# Altium schematic sheet I2cLevelShifter.SchDoc
size A; DocumentNumber: D_21; SheetNumber: 21; SheetTotal: 21
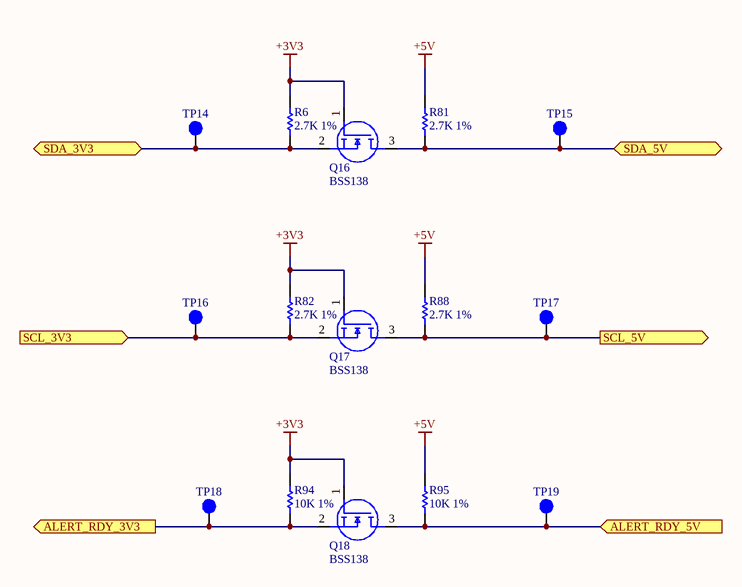
[diagram p0: I2cLevelShifter.SchDoc]

## Parts
Q16  BSS138  [SOT-23-3]
Q17  BSS138  [SOT-23-3]
Q18  BSS138  [SOT-23-3]
R6  2.7K 1%  [R0805]
R81  2.7K 1%  [R0805]
R82  2.7K 1%  [R0805]
R88  2.7K 1%  [R0805]
R94  10K 1%  [R0805]
R95  10K 1%  [R0805]
TP14  T  [TESTPOINTSMD_1x1MM]  (value not drawn)  (no BOM)
TP15  T  [TESTPOINTSMD_1x1MM]  (value not drawn)  (no BOM)
TP16  T  [TESTPOINTSMD_1x1MM]  (value not drawn)  (no BOM)
TP17  T  [TESTPOINTSMD_1x1MM]  (value not drawn)  (no BOM)
TP18  T  [TESTPOINTSMD_1x1MM]  (value not drawn)  (no BOM)
TP19  T  [TESTPOINTSMD_1x1MM]  (value not drawn)  (no BOM)

## Ports
ALERT_RDY_3V3 (out), ALERT_RDY_5V (in), SCL_3V3 (in), SCL_5V (out), SDA_3V3 (bidir), SDA_5V (bidir)

## Nets
+3V3: Q16.1(G) Q17.1(G) Q18.1(G) R6.2 R82.2 R94.2
+5V: R81.2 R88.2 R95.2
ALERT_RDY_3V3: Q18.2(S) R94.1 TP18.1 ; port ALERT_RDY_3V3
ALERT_RDY_5V: Q18.3(D) R95.1 TP19.1 ; port ALERT_RDY_5V
SCL_3V3: Q17.2(S) R82.1 TP16.1 ; port SCL_3V3
SCL_5V: Q17.3(D) R88.1 TP17.1 ; port SCL_5V
SDA_3V3: Q16.2(S) R6.1 TP14.1 ; port SDA_3V3
SDA_5V: Q16.3(D) R81.1 TP15.1 ; port SDA_5V

## Library data of the parts
Q16-Q18 = BSS138: MOSFET N-CH 50V 220MA SOT-23; Manufacturer: ON Semiconductor / Fairchild; Element Configuration: Single; Rds On Max: 3.5R; Input Capacitance: 27pF; Max Power Dissipation: 360mW; Rise Time: 9ns; Turn-Off Delay Time: 20ns; Gate to Source Voltage (Vgs): 20V; Turn-On Delay Time: 2.5ns; Number of Elements: 1; Threshold Voltage: 1.3V; On-State Resistance: 6R; Supplier 1: Mouser; Manufacturer Part Number: BSS138; RoHS: Yes; Category: MOSFETs; Stock 1: 736044; Pricing 1: 1=0.26000, 10=0.17800, 100=0.07400, 1000=0.05000, 3000=0.03900, 9000=0.03300, 24000=0.03100, 45000=0.02900 (USD); Mount: Surface Mount; Case/Package: SOT-23; Number of Pins: 3; Weight: 0.03g; Contact Plating: Tin,Matte; Min Operating Temperature: -55°C; Max Operating Temperature: 150°C; Packaging: Tape and Reel; Continuous Drain Current (ID): 220mA; Drain to Source Voltage (Vdss): 50V; Drain to Source Breakdown Voltage: 50V; Fall Time: 9ns; Drain to Source Resistance: 3.5R; Package Quantity: 1; Power Dissipation: 360mW; Voltage Rating (DC): 50V; Current Rating: 220mA; Nominal Vgs: 1.3V; Dual Supply Voltage: 50V; Termination: SMD/SMT; Length: 2.92mm; Height: 0.93mm; Width: 1.3mm; Radiation Hardening: No; Lead Free: Lead Free; REACH SVHC: No SVHC; ComponentLink1URL: https://datasheet.ciiva.com/931/bss138-931776.pdf?src-supplier=Digi-Key; ComponentLink1Description: https://datasheet.ciiva.com/931/bss138-931776.pdf?src-supplier=Digi-Key; ComponentLink2URL: https://datasheet.ciiva.com/1190/193736-1190130.pdf?src-supplier=Element14; ComponentLink2Description: https://datasheet.ciiva.com/1190/193736-1190130.pdf?src-supplier=Element14; ComponentLink3URL: https://datasheet.ciiva.com/27050/784896-27050043.pdf?src-supplier=Jameco; ComponentLink3Description: https://datasheet.ciiva.com/27050/784896-27050043.pdf?src-supplier=Jameco; ComponentLink4URL: https://datasheet.ciiva.com/1190/193736-1190131.pdf?src-supplier=Element14; ComponentLink4Description: https://datasheet.ciiva.com/1190/193736-1190131.pdf?src-supplier=Element14; ComponentLink5URL: https://datasheet.ciiva.com/1254/193736-1254983.pdf?src-supplier=Newark; ComponentLink5Description: https://datasheet.ciiva.com/1254/193736-1254983.pdf?src-supplier=Newark; ComponentLink6URL: https://datasheet.ciiva.com/16834/bss138-16834843.pdf?src-supplier=Future+Electronics; ComponentLink6Description: https://datasheet.ciiva.com/16834/bss138-16834843.pdf?src-supplier=Future+Electronics; ComponentLink7URL: https://datasheet.ciiva.com/26229/bss138-26229007.pdf?src-supplier=Avnet+Europe; ComponentLink7Description: https://datasheet.ciiva.com/26229/bss138-26229007.pdf?src-supplier=Avnet+Europe; ComponentLink8URL: https://datasheet.ciiva.com/3304/bss138-3304424.pdf?src-supplier=Avnet; ComponentLink8Description: https://datasheet.ciiva.com/3304/bss138-3304424.pdf?src-supplier=Avnet; ComponentLink9URL: https://datasheet.ciiva.com/22655/193736-22655240.pdf?src-supplier=Element14; ComponentLink9Description: https://datasheet.ciiva.com/22655/193736-22655240.pdf?src-supplier=Element14; Supplier Part Number 1: 512-BSS138
R6 R81 R82 R88 = AC0805FR-072K7L: RES SMD 2.7K OHM 1% 1/8W 0805; Manufacturer: Yageo; Resistance: 2.7kR; Temperature Coefficient: 100ppm/°C; Power Rating: 125mW; Voltage Rating: 150V; Supplier 1: Mouser; Supplier Part Number 1: 603-AC0805FR-072K7L; Manufacturer Part Number: AC0805FR-072K7L; RoHS: Yes; Category: Chip SMD Resistors; Stock 1: 3900; Pricing 1: 1=0.16000, 10=0.03700, 100=0.01300, 1000=0.01000, 5000=0.00600, 10000=0.00600 (USD); Case/Package: 0805; Case Code (Metric): 2012; Case Code (Imperial): 0805; Min Operating Temperature: -55°C; Max Operating Temperature: 155°C; Packaging: Tape and Reel; Composition: Thick Film; Tolerance: 1%; Number of Terminations: 2; Termination: SMD/SMT; Max Power Dissipation: 125mW; Features: Moisture Resistant,Automotive AEC-Q200; Length: 0.079inch; Height: 0.024inch; Width: 0.049inch; Lead Free: Lead Free; ComponentLink1URL: https://datasheet.ciiva.com/12656/pyu-ac-51-rohs-l-2-12656732.pdf?src-supplier=Mouser; ComponentLink1Description: https://datasheet.ciiva.com/12656/pyu-ac-51-rohs-l-2-12656732.pdf?src-supplier=Mouser
R94 R95 = CRCW080510K0FKEA: VISHAY - CRCW080510K0FKEA - SMD Chip Resistor, 0805 [2012 Metric], 10 kohm, CRCW e3 Series, 150 V, Thick Film, 125 mW; Resistance: 10kR; Temperature Coefficient: 100ppm/°C; Power Rating: 125mW; Voltage Rating: 150V; Supplier 1: Mouser; Supplier Part Number 1: 71-CRCW0805-10K-E3; Manufacturer: Vishay; Manufacturer Part Number: CRCW080510K0FKEA; RoHS: Yes; Category: Chip SMD Resistors; Stock 1: 1138857; Pricing 1: 1=0.10000, 10=0.06200, 100=0.02500, 1000=0.01000, 5000=0.00700, 10000=0.00600 (USD); Case/Package: 0805; Case Code (Metric): 2012; Case Code (Imperial): 0805; Min Operating Temperature: -55°C; Max Operating Temperature: 155°C; Packaging: Tape and Reel; Composition: Thick Film; Tolerance: 1%; Voltage Rating (DC): 150V; Termination: SMD/SMT; Package Quantity: 5000; Military Standard: Not; Length: 2mm; Height: 0.45mm; Width: 1.25mm; Depth: 1.25mm; Lead Free: Lead Free; REACH SVHC: Unknown; ComponentLink1URL: https://datasheet.ciiva.com/11808/0900766b80d98b26-11808216.pdf?src-supplier=RSComponents; ComponentLink1Description: https://datasheet.ciiva.com/11808/0900766b80d98b26-11808216.pdf?src-supplier=RSComponents; ComponentLink2URL: https://datasheet.ciiva.com/5547/dcrcwe3-109170-5547559.pdf?src-supplier=Mouser; ComponentLink2Description: https://datasheet.ciiva.com/5547/dcrcwe3-109170-5547559.pdf?src-supplier=Mouser; ComponentLink3URL: https://datasheet.ciiva.com/16719/70201119-16719082.pdf?src-supplier=Allied+Electronics; ComponentLink3Description: https://datasheet.ciiva.com/16719/70201119-16719082.pdf?src-supplier=Allied+Electronics; ComponentLink4URL: https://datasheet.ciiva.com/16883/dcrcwe3-16883708.pdf?src-supplier=Avnet+Europe; ComponentLink4Description: https://datasheet.ciiva.com/16883/dcrcwe3-16883708.pdf?src-supplier=Avnet+Europe; ComponentLink5URL: https://datasheet.ciiva.com/8337/dcrcwe3-8337773.pdf?src-supplier=Avnet; ComponentLink5Description: https://datasheet.ciiva.com/8337/dcrcwe3-8337773.pdf?src-supplier=Avnet; ComponentLink6URL: https://datasheet.ciiva.com/46394/1720486-46394381.pdf?src-supplier=Element14; ComponentLink6Description: https://datasheet.ciiva.com/46394/1720486-46394381.pdf?src-supplier=Element14; Weight: 0.000194oz; Contact Plating: Tin; Radiation Hardening: No; ComponentLink7URL: https://datasheet.ciiva.com/16199/dcrcwe3-16199086.pdf?src-supplier=Future+Electronics; ComponentLink7Description: https://datasheet.ciiva.com/16199/dcrcwe3-16199086.pdf?src-supplier=Future+Electronics; ComponentLink8URL: https://datasheet.ciiva.com/16514/dcrcwe3-16514907.pdf?src-supplier=Avnet+Asia; ComponentLink8Description: https://datasheet.ciiva.com/16514/dcrcwe3-16514907.pdf?src-supplier=Avnet+Asia; ComponentLink9URL: https://datasheet.ciiva.com/16755/70201119-16755389.pdf?src-supplier=Allied+Electronics; ComponentLink9Description: https://datasheet.ciiva.com/16755/70201119-16755389.pdf?src-supplier=Allied+Electronics; ComponentLink10URL: https://datasheet.ciiva.com/8337/dcrcwe3-8337774.pdf?src-supplier=Avnet; ComponentLink10Description: https://datasheet.ciiva.com/8337/dcrcwe3-8337774.pdf?src-supplier=Avnet
TP14-TP19 = TestPoint_SMD_1x1: SMD Test Point